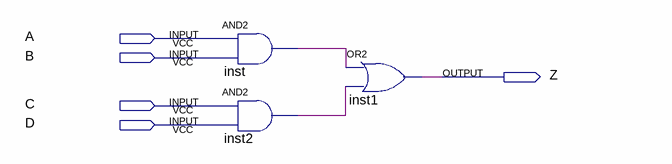
[diagram p0: schematic sheet]
// Quartus schematic boolean1.bdf as structural Verilog: 3 symbols, 5 pins
module boolean1 (
  input  A,
  input  B,
  input  C,
  input  D,
  output Z
);

  wire inst2_out, inst_out;

  and inst (inst_out, A, B);
  and inst2 (inst2_out, C, D);
  or inst1 (Z, inst_out, inst2_out);
endmodule
